# EAGLE design RJ-45 Sensor Breakout Logo 2 Fin (EAGLE 7.3.0)
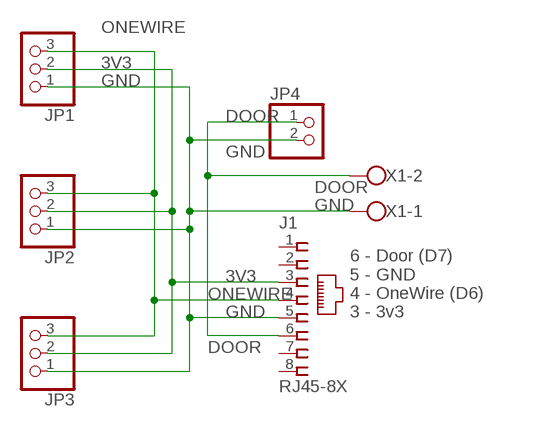
[diagram p0: schematic, sheet 1]

## Parts
J1  RJ45-8X  [RJ45-NO-SHIELD-NOLINE]
JP1  PINHD-1X3  [1X03]
JP2  PINHD-1X3  [1X03]
JP3  PINHD-1X3  [1X03]
JP4  PINHD-1X2  [1X02]
X1  W237-102  [W237-102]

## Nets
3V3: J1.3 JP1.2 JP2.2 JP3.2
DOOR: J1.6 JP4.1 X1.2
GND: J1.5 JP1.1 JP2.1 JP3.1 JP4.2 X1.1
ONEWIRE: J1.4 JP1.3 JP2.3 JP3.3
Unconnected: J1.1 J1.2 J1.7 J1.8

## Notes on the sheet
- 6 - Door (D7)
  5 - GND
  4 - OneWire (D6) 
  3 - 3v3

## Library data of the parts
J1 = con-tycoelectronics:RJ45: CORCOM Modular RJ Jacks No Shield Source: www.tycoelectronics.com .. ENG_DS_1654001_1099_RJ_L_0507.pdf; MPN: RJ45-8X; OC_FARNELL: unknown; OC_NEWARK: 16R6101
JP1-JP3 = pinhead:PINHD-1X3: PIN HEADER
JP4 = pinhead:PINHD-1X2: PIN HEADER
X1 = con-wago-500:W237-102: WAGO SCREW CLAMP; MPN: 237-102; OC_FARNELL: unknown; OC_NEWARK: 70K9898

## Board
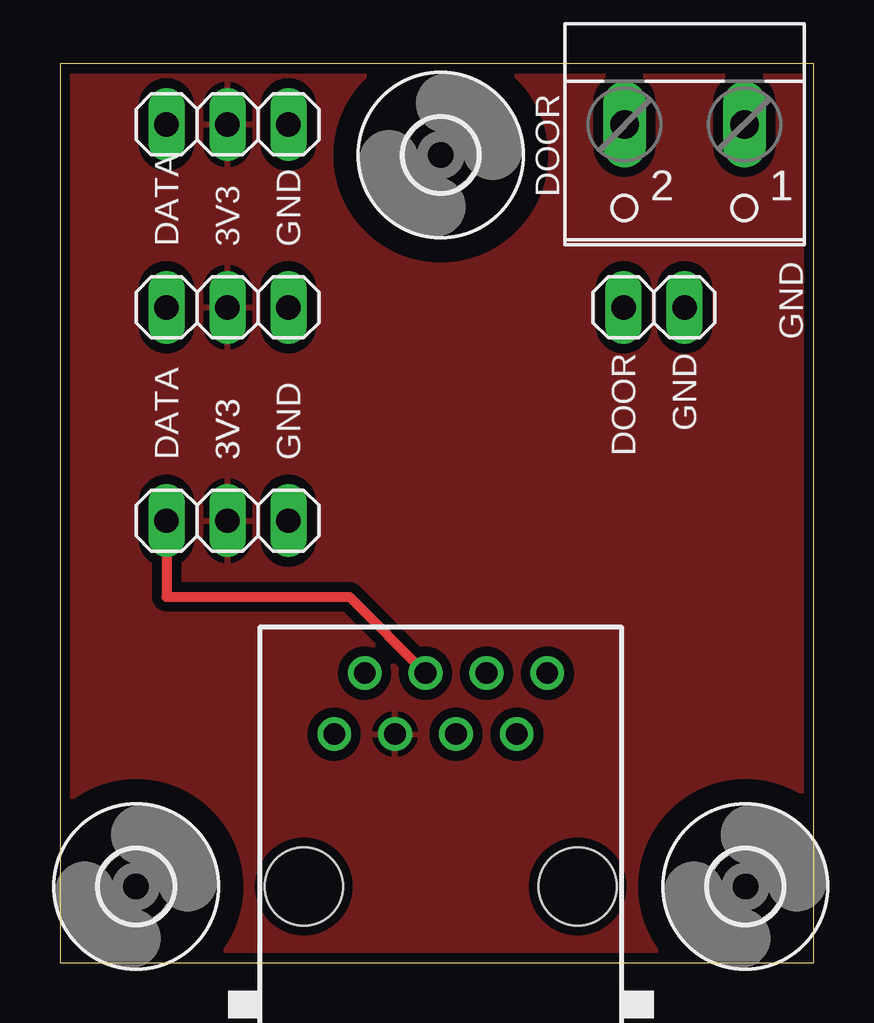
[diagram p1: board, top side]
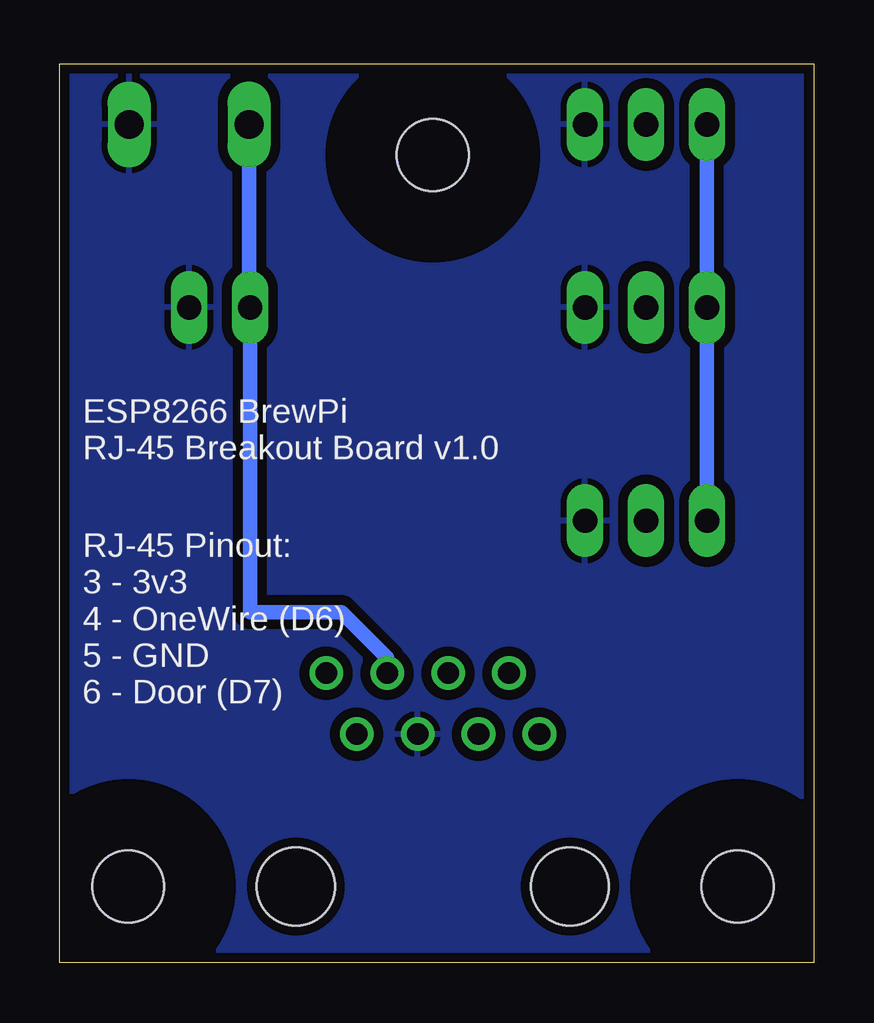
[diagram p2: board, bottom side, seen from below]

Size 31.42 x 37.45 mm. Coordinates in mm from the lower left corner, seen from the top.
Outline: 0,0 31.42,0 31.42,37.45 0,37.45 0,0
Copper layers (1*16): Top 0.0356mm / dielectric 1.5011mm / Bottom 0.0356mm
Design rules "PCBs_io": minimum track width 6mil, minimum drill 13mil, track to track 6mil, track to pad 6mil, pad to pad 6mil, via to via 6mil, smd to smd 6mil, copper to edge 15mil, drill to drill 6mil, minimum pad ring 7mil, minimum via ring 7mil, stop-mask expansion 3mil, vias tented up to drill 0mil, thermal gap 10mil

### Footprints (pad centres in the part's own frame; a part is rotated, then mirrored left to right if it is on the bottom)
RJ45-NO-SHIELD-NOLINE = drill 0.9 pad 1.4: 1 -4.445,6.35; 2 -3.175,8.89; 3 -1.905,6.35; 4 -0.635,8.89; 5 0.635,6.35; 6 1.905,8.89; 7 3.175,6.35; 8 4.445,8.89 | hole 3.251: -5.715,0; 5.715,0
1X03 = drill 1.016 long: 1 -2.54,0; 2 0,0; 3 2.54,0
1X02 = drill 1.016 long: 1 -1.27,0; 2 1.27,0
3,0 = hole 3: 0,0
W237-102 = drill 1.194 long: 1 -2.5,-1.27; 2 2.5,-1.27

### Placement (x,y rotation side)
J1  15.88,3.17 0 top
JP1  6.98,18.41 180 top
JP2  6.98,27.3 180 top
JP3  6.98,34.92 180 top
JP4  24.77,27.3 0 top
U$1  [3,0]  28.58,3.17 0 top
U$2  [3,0]  3.17,3.17 0 top
U$3  [3,0]  15.88,33.66 0 top
X1  26.04,33.66 180 top

### Tracks (layer width: path | path; a pad name or v marks a point on that pad's centre or on a via)
3V3
  pour Top (isolate 0.406): 0,37.46 31.75,37.46 31.75,0 0,0
DOOR
  Bottom 0.61: X1.2 23.54,27.3 JP4.1 23.5,14.61 19.69,14.61 17.78,12.7 J1.6
GND
  pour Bottom (isolate 0.406): 0,37.46 31.75,37.46 31.75,0 0,0
ONEWIRE
  Top 0.406: JP1.3 4.45,15.24 12.06,15.24 J1.4
  Bottom 0.61: JP1.3 JP2.3 JP3.3

### Text on the board
tNames: DOOR | DATA | 3V3 | GND | GND | DOOR | GND | DATA | 3V3 | 3V3 | GND
bNames: ESP8266 BrewPi / RJ-45 Breakout Board v1.0 | RJ-45 Pinout: / 3 - 3v3 / 4 - OneWire (D6) / 5 - GND / 6 - Door (D7)